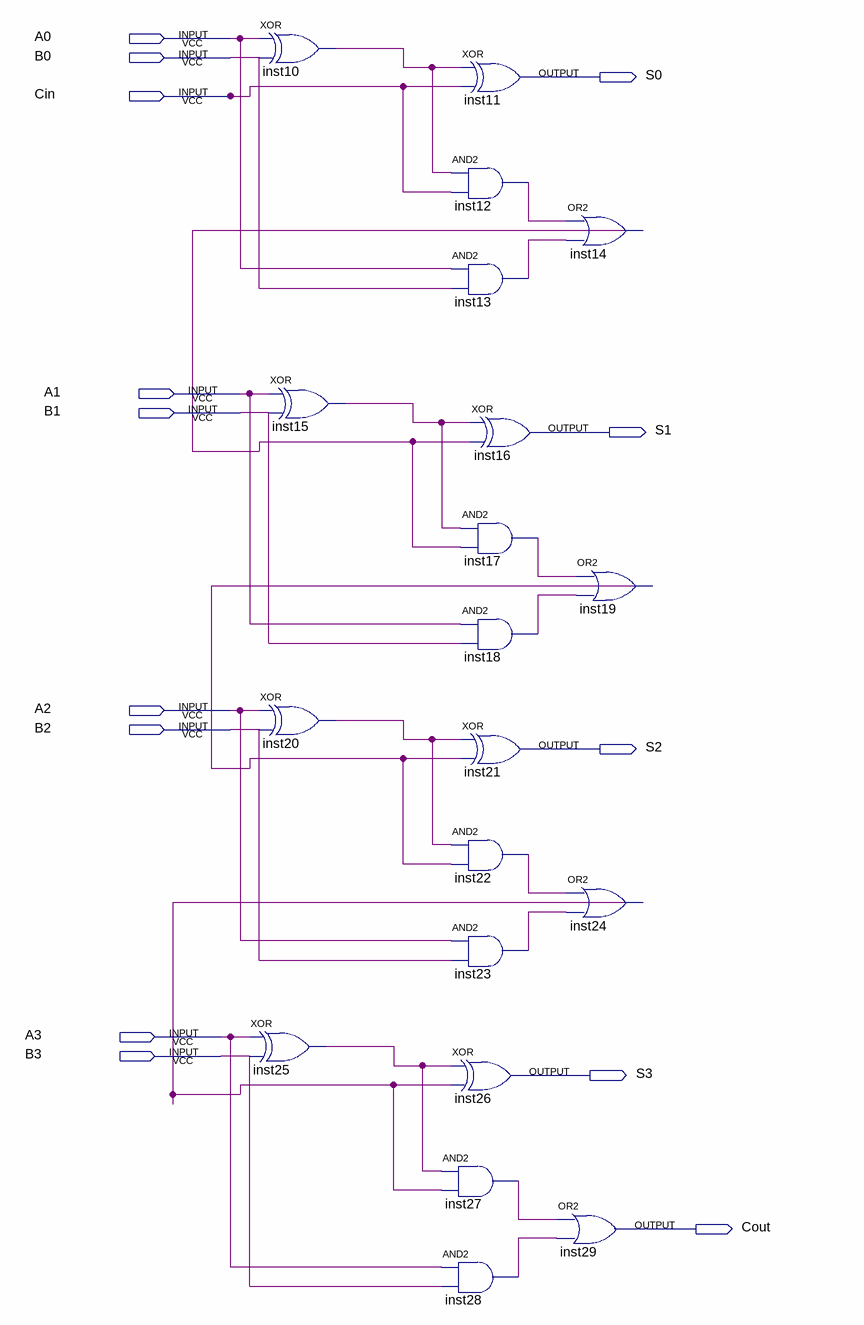
[diagram p0: schematic sheet]
// Quartus schematic pr1.bdf as structural Verilog: 20 symbols, 14 pins
module pr1 (
  input  A0,
  input  B0,
  input  Cin,
  input  A1,
  input  B1,
  input  A2,
  input  B2,
  input  A3,
  input  B3,
  output S0,
  output S1,
  output S2,
  output S3,
  output Cout
);

  wire inst10_out, inst12_out, inst13_out, inst14_out, inst15_out, inst17_out, inst18_out, inst19_out,
       inst20_out, inst22_out, inst23_out, inst24_out, inst25_out, inst27_out, inst28_out;

  xor inst10 (inst10_out, A0, B0);
  xor inst15 (inst15_out, A1, B1);
  xor inst20 (inst20_out, A2, B2);
  xor inst25 (inst25_out, A3, B3);
  and inst27 (inst27_out, inst25_out, inst24_out);
  and inst28 (inst28_out, A3, B3);
  xor inst11 (S0, inst10_out, Cin);
  and inst12 (inst12_out, inst10_out, Cin);
  and inst13 (inst13_out, A0, B0);
  xor inst16 (S1, inst15_out, inst14_out);
  and inst17 (inst17_out, inst15_out, inst14_out);
  and inst18 (inst18_out, A1, B1);
  xor inst21 (S2, inst20_out, inst19_out);
  and inst22 (inst22_out, inst20_out, inst19_out);
  and inst23 (inst23_out, A2, B2);
  xor inst26 (S3, inst25_out, inst24_out);
  or inst14 (inst14_out, inst12_out, inst13_out);
  or inst19 (inst19_out, inst17_out, inst18_out);
  or inst24 (inst24_out, inst22_out, inst23_out);
  or inst29 (Cout, inst27_out, inst28_out);
endmodule
